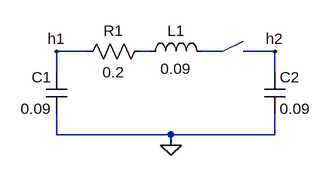
[diagram p0: schematic hydres0.asc]
hydres0.asc, the LTspice schematic file:
Version 4
SHEET 1 880 680
WIRE 64 96 16 96
WIRE 160 96 144 96
WIRE 272 96 304 80
WIRE 272 96 240 96
WIRE 352 96 304 96
WIRE 16 128 16 96
WIRE 352 128 352 96
WIRE 16 224 16 192
WIRE 192 224 16 224
WIRE 352 224 352 192
WIRE 352 224 192 224
WIRE 192 240 192 224
FLAG 192 240 0
FLAG 16 96 h1
FLAG 352 96 h2
SYMBOL ind 144 112 R270
WINDOW 0 32 56 VTop 2
WINDOW 3 5 56 VBottom 2
SYMATTR InstName L1
SYMATTR Value 0.09
SYMBOL cap 32 128 M0
SYMATTR InstName C1
SYMATTR Value 0.09
SYMBOL cap 336 128 R0
SYMATTR InstName C2
SYMATTR Value 0.09
SYMBOL res 160 80 R90
WINDOW 0 0 56 VBottom 2
WINDOW 3 32 56 VTop 2
SYMATTR InstName R1
SYMATTR Value 0.2

The netlist it stands for:
* hydres0.asc
L1 N001 N002 0.09
C1 h1 0 0.09
C2 h2 0 0.09
R1 N001 h1 0.2
.backanno
.end